# Altium schematic sheet top.SchDoc
size A4; SheetNumber: 1; SheetTotal: 8
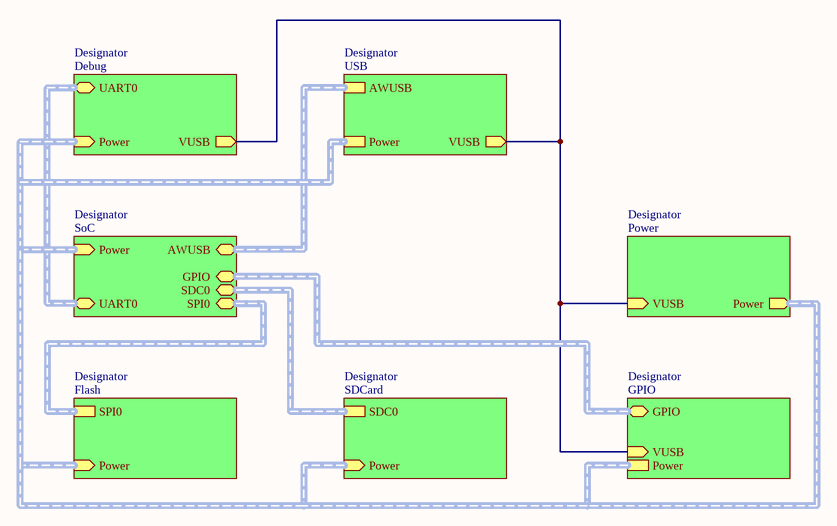
[diagram p0: top.SchDoc]

## Sub-sheets
Designator = SoC: SDC0 (bidir, harness SDC0), SPI0 (bidir, harness SPI0), AWUSB (bidir, harness AWUSB), Power (in, harness Power), GPIO (bidir), UART0 (bidir)
Designator = Power: Power (out, harness Power), VUSB (in)
Designator = USB: AWUSB (harness AWUSB), VUSB (out), Power
Designator = Flash: SPI0 (harness SPI0), Power (in, harness Power)
Designator = SDCard: SDC0 (harness SDC0), Power (in, harness Power)
Designator = GPIO: GPIO (bidir), Power (harness Power), VUSB (in)
Designator = Debug: Power (in), UART0 (bidir), VUSB (out)

## Nets
(unnamed): sheet Designator/VUSB, sheet Designator/VUSB, sheet Designator/VUSB, sheet Designator/VUSB